# Altium schematic sheet QRE1113.SchDoc
size A4; SheetNumber: 1; SheetTotal: 1
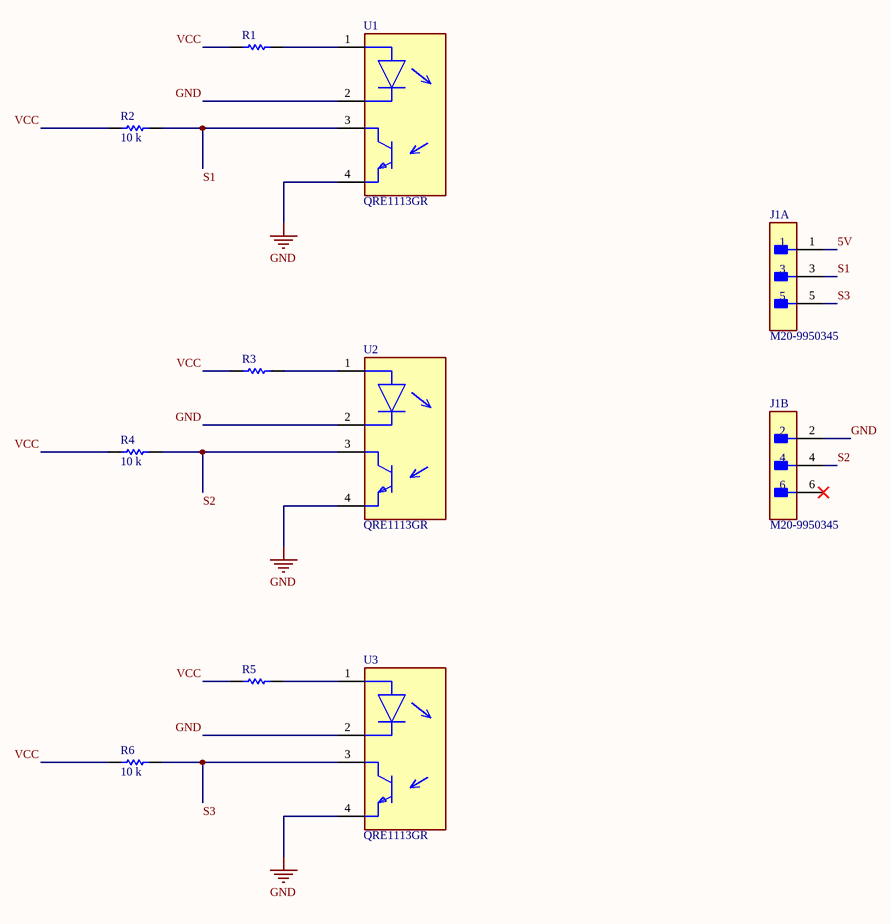
[diagram p0: QRE1113.SchDoc]

## Parts
J1  M20-9950345  [FP-M20-9950345-MFG]  (parts A,B of 2)
R1  CRCW0805100RFKEA  [RESC2013X50X30ML20T20]  (value not drawn)
R2  10 k  [RESC2013X60X30ML20T20]
R3  CRCW0805100RFKEA  [RESC2013X50X30ML20T20]  (value not drawn)
R4  10 k  [RESC2013X60X30ML20T20]
R5  CRCW0805100RFKEA  [RESC2013X50X30ML20T20]  (value not drawn)
R6  10 k  [RESC2013X60X30ML20T20]
U1  QRE1113GR  [FP-100CY-MFG]
U2  QRE1113GR  [FP-100CY-MFG]
U3  QRE1113GR  [FP-100CY-MFG]

## Nets
GND: J1.2 U1.2(C) U1.4(E) U2.2(C) U2.4(E) U3.2(C) U3.4(E)
5V: J1.1
S1: J1.3 R2.2 U1.3(C)
S2: J1.4 R4.2 U2.3(C)
S3: J1.5 R6.2 U3.3(C)
VCC: R1.1 R2.1 R3.1 R4.1 R5.1 R6.1
NetR1_2: R1.2 U1.1(A)
NetR3_2: R3.2 U2.1(A)
NetR5_2: R5.2 U3.1(A)

Not connected (* = marked no-connect by the designer): J1 6*

## Library data of the parts
J1 = CMP-15831-000002-1: CONN HEADER R/A 6POS 2.54MM; Manufacturer: Harwin; Conn Gender: Male; Number Of Contacts: 6; Conn Orientation: Right Angle; Current Rating: 3A; Device Class L2: Headers and Wire Housings; Temperature: -40°C to +105°C; Device Class L1: Connectors; RoHS: TRUE; Temperature Range Low: -40°C; ComponentLink2URL: https://cdn.harwin.com/pdfs/M20-995.pdf; Height: 5.28mm; Digikey Description: CONN HEADER R/A 6POS 2.54MM; Pitch: 2.54mm; Manufacturer Part Number: M20-9950345; Device Class L3: unset; Ipc Land Pattern Name: DFN400X400X80-14; Automotive: No; Octopart: https://octopart.com/m20-9950345-harwin-21265213; Category: Conn; Mouser Description: Headers & Wire Housings 03+03 DIL HORIZONTAL PIN HEADER GOLD HT; Package: 0; Number Of Rows: 2; Contact Material: Gold,Nickel; Lead Free: Yes; ComponentLink2Description: Datasheet; Temperature Range High: +105°C
R1 R3 R5 = CMP-2001-04901-1: Manufacturer: Vishay Dale; Part Number: CRCW0805100RFKEA
R2 R4 R6 = CMP-2001-04657-1: 10 kOhms ±5% 0.25W, 1/4W Chip Resistor 0805 (2012 Metric) Automotive AEC-Q200, Moisture Resistant Thick Film; Part Number: RK73B2ATTD103J; Manufacturer: KOA Speer
U1-U3 = CMP-2000-06919-2: SENSOR OPTO TRANS REFL SMD PHOTO; Wavelength: 940nm; Fall Time: 20us; Forward Current: 50mA; Max Power Dissipation: 75mW; Operating Supply Voltage: 1.7V; Reverse Voltage (DC): 5V; Max Breakdown Voltage: 30V; Forward Voltage: 1.2V; Output Type: Phototransistor; Number of Elements: 1; Sensing Distance: 0.197inch; Max Collector Current: 20mA; Contact Plating: Tin; Packaging: Tape and Reel; Rise Time: 20us; Response Time: 20us; Case/Package: SMD/SMT; REACH SVHC: No SVHC; Lead Free: Lead Free; Width: 2.9mm; Package Quantity: 1000; Mount: Surface Mount; Input Current: 50mA; Max Operating Temperature: 85°C; Weight: 0.078g; Power Dissipation: 75mW; Reverse Breakdown Voltage: 5V; Collector Emitter Voltage (VCEO): 30V; Collector Emitter Breakdown Voltage: 30V; Number of Pins: 4; Min Operating Temperature: -40°C; Radiation Hardening: No; Height: 1.7mm; Number of Channels: 1; Length: 3.6mm